# Altium schematic sheet Logic_IO_Unit_V2.SchDoc: Logic IO System
size A4; DocumentNumber: 12; SheetNumber: 12; SheetTotal: 50
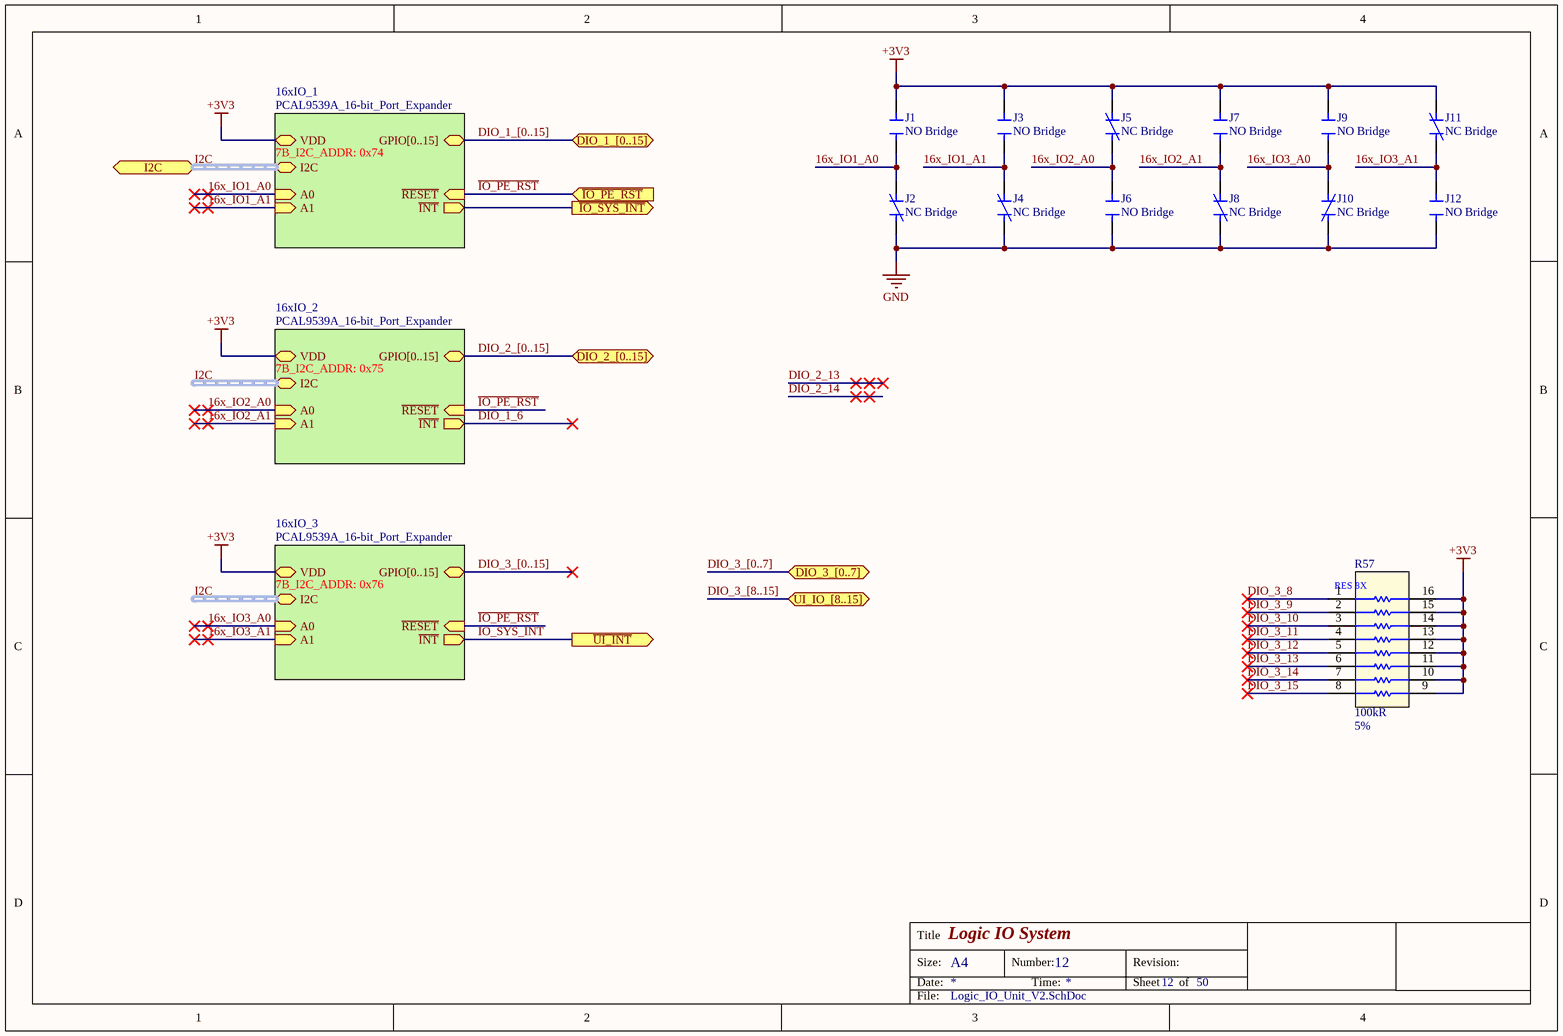
[diagram p0: Logic_IO_Unit_V2.SchDoc]

## Parts
J1  NO Bridge  [NO_SolderBridge_0603]  (no BOM)
J2  NC Bridge  [NC_SolderBridge_0603]  (net tie, no BOM)
J3  NO Bridge  [NO_SolderBridge_0603]  (no BOM)
J4  NC Bridge  [NC_SolderBridge_0603]  (net tie, no BOM)
J5  NC Bridge  [NC_SolderBridge_0603]  (net tie, no BOM)
J6  NO Bridge  [NO_SolderBridge_0603]  (no BOM)
J7  NO Bridge  [NO_SolderBridge_0603]  (no BOM)
J8  NC Bridge  [NC_SolderBridge_0603]  (net tie, no BOM)
J9  NO Bridge  [NO_SolderBridge_0603]  (no BOM)
J10  NC Bridge  [NC_SolderBridge_0603]  (net tie, no BOM)
J11  NC Bridge  [NC_SolderBridge_0603]  (net tie, no BOM)
J12  NO Bridge  [NO_SolderBridge_0603]  (no BOM)
R57  Resistance: 100kR  Tolerance: 5%  [YAG_YC248]  (hidden comment: RES ARRAY 8 RES 100K OHM 1606)

## Sub-sheets
16xIO_1 = PCAL9539A_16-bit_Port_Expander: GPIO[0..15] (bidir), A0 (in), A1 (in), ~{RESET} (in), VDD, I2C (harness I2C), ~{INT} (out)  | 7B_I2C_ADDR: 0x74
16xIO_2 = PCAL9539A_16-bit_Port_Expander: GPIO[0..15] (bidir), A0 (in), A1 (in), ~{RESET} (in), VDD, I2C (harness I2C), ~{INT} (out)  | 7B_I2C_ADDR: 0x75
16xIO_3 = PCAL9539A_16-bit_Port_Expander: GPIO[0..15] (bidir), A0 (in), A1 (in), ~{RESET} (in), VDD, I2C (harness I2C), ~{INT} (out)  | 7B_I2C_ADDR: 0x76

## Ports
DIO_1_[0..15] (bidir), DIO_2_[0..15] (bidir), DIO_3_[0..7] (bidir), I2C (harness I2C), UI_IO_[8..15] (bidir), ~{IO_PE_RST} (in), ~{IO_SYS_INT} (out), ~{UI_INT} (out)

## Nets
+3V3: J1.2 J3.2 J5.2 J7.2 J9.2 J11.2 R57.9 R57.10 R57.11 R57.12 R57.13 R57.14 R57.15 R57.16 ; sheet 16xIO_1/VDD, sheet 16xIO_2/VDD, sheet 16xIO_3/VDD
GND: J2.1 J4.1 J6.1 J8.1 J10.1 J12.1
16x_IO1_A0: J1.1 J2.2 ; sheet 16xIO_1/A0
16x_IO1_A1: J3.1 J4.2 ; sheet 16xIO_1/A1
16x_IO2_A0: J5.1 J6.2 ; sheet 16xIO_2/A0
16x_IO2_A1: J7.1 J8.2 ; sheet 16xIO_2/A1
16x_IO3_A0: J9.1 J10.2 ; sheet 16xIO_3/A0
16x_IO3_A1: J11.1 J12.2 ; sheet 16xIO_3/A1
~{IO_PE_RST}: port ~{IO_PE_RST}, sheet 16xIO_1/~{RESET}, sheet 16xIO_2/~{RESET}, sheet 16xIO_3/~{RESET}
~{IO_SYS_INT}: port ~{UI_INT}, sheet 16xIO_3/~{INT}
~{IO_SYS_INT}: port ~{IO_SYS_INT}, sheet 16xIO_1/~{INT}  [a separate net that carries the same name]
DIO_1_6: sheet 16xIO_2/~{INT}
DIO_3_8: R57.1
DIO_3_9: R57.2
DIO_3_10: R57.3
DIO_3_11: R57.4
DIO_3_12: R57.5
DIO_3_13: R57.6
DIO_3_14: R57.7
DIO_3_15: R57.8

## Buses and harness runs
bus DIO_1_[0..15] = port DIO_1_[0..15] = sheet 16xIO_1/GPIO[0..15]
bus DIO_2_[0..15] = port DIO_2_[0..15] = sheet 16xIO_2/GPIO[0..15]
bus DIO_3_[0..7] = port DIO_3_[0..7]
bus DIO_3_[0..15] = sheet 16xIO_3/GPIO[0..15]
bus DIO_3_[8..15] = port UI_IO_[8..15]
harness I2C = port I2C = sheet 16xIO_1/I2C
harness I2C = sheet 16xIO_2/I2C
harness I2C = sheet 16xIO_3/I2C

## Notes on the sheet
- Title
- Size:
- Date:
- A4
- Number:
- Time:
- Revision:
- Sheet
- of
- File:
- (in symbol RES ARRAY 8 RES 100K OHM 1606) RES 8X

## Library data of the parts
J1 J3 J6 J7 J9 J12 = NO Bridge: NO PCB Bridge (May be closed by a solder blob)
  J1 J3: ClassName: 16xIO_1
  J6 J7: ClassName: 16xIO_2
  J9 J12: ClassName: 16xIO_3
J2 J4 J5 J8 J10 J11 = NC Bridge: NC PCB Bridge (May be opened by cutting the copper trace)
  J2 J4: ClassName: 16xIO_1
  J5 J8: ClassName: 16xIO_2
  J10 J11: ClassName: 16xIO_3
R57 = RES ARRAY 8 RES 100K OHM 1606: 100k Ohm ±5% 62.5mW Power Per Element Isolated  Resistor Network/Array ±200ppm/°C 1606, Convex, Long Side Terminals; Manufacturer: Yageo; Manufacturer Part Number: YC248-JR-07100KL; Number of Resistors: 8; Number of Contacts: 16; Voltage Rating: 50V; Supplier 1: Digi-Key; Stock 1: 5800; Pricing 1: 1=0.3, 10=0.251, 25=0.1828, 50=0.1324, 100=0.0982, 250=0.0754, 500=0.0594, 1000=0.0411 (USD); Mount: Surface Mount; Case/Package: 0616; Number of Pins: 16; Number of Terminals: 16; Case Code (Metric): 1640; Case Code (Imperial): 0616; Min Operating Temperature: -55°C; Max Operating Temperature: 155°C; Temperature Coefficient: 200ppm/°C; Power Rating: 62.5mW; Number of Circuits: 8; Number of Elements: 8; Package Quantity: 1; Packaging: Tape and Reel; Circuit Type: Isolated; Power Per Element: 62.5mW; Military Standard: Not; Termination: Convex; Length: 0.157inch; Height: 0.022inch; Width: 0.063inch; Terminal Pitch: 0.5mm; Depth: 1.6mm; REACH SVHC: No SVHC; Lead Free: Lead Free; ComponentLink1URL: https://media.digikey.com/pdf/Data%20Sheets/Yageo%20PDFs/YC102-358,TC122-164_Series_DS.pdf?src-supplier=Digi-Key; ComponentLink1Description: https://media.digikey.com/pdf/Data%20Sheets/Yageo%20PDFs/YC102-358,TC122-164_Series_DS.pdf?src-supplier=Digi-Key; ComponentLink2URL: http://www.yageo.com/documents/recent/PYu-YC248_51_RoHS_L_2.pdf?src-supplier=Digi-Key; ComponentLink2Description: http://www.yageo.com/documents/recent/PYu-YC248_51_RoHS_L_2.pdf?src-supplier=Digi-Key; ComponentLink3URL: http://www.yageo.com/NewPortal/yageodocoutput?fileName=/pdf/R-Chip/PYu-YC_TC_group_51_RoHS_L_0.pdf&src-supplier=Digi-Key; ComponentLink3Description: http://www.yageo.com/NewPortal/yageodocoutput?fileName=/pdf/R-Chip/PYu-YC_TC_group_51_RoHS_L_0.pdf&src-supplier=Digi-Key; ComponentLink4URL: http://www.yageo.com/documents/recent/PYu-YC248_51_RoHS_L_(2).pdf?src-supplier=Avnet+Europe; ComponentLink4Description: http://www.yageo.com/documents/recent/PYu-YC248_51_RoHS_L_(2).pdf?src-supplier=Avnet+Europe; Supplier Part Number 1: YC248J-100KCT-ND; Voltage Rating (DC): 50V; Composition: Thick Film; Radiation Hardening: No; ComponentLink5URL: http://www.farnell.com/datasheets/443139.pdf?src-supplier=Element14; ComponentLink5Description: http://www.farnell.com/datasheets/443139.pdf?src-supplier=Element14; ClassName: 16xIO_3